# EAGLE design pi_pcb (EAGLE 9.5.1)
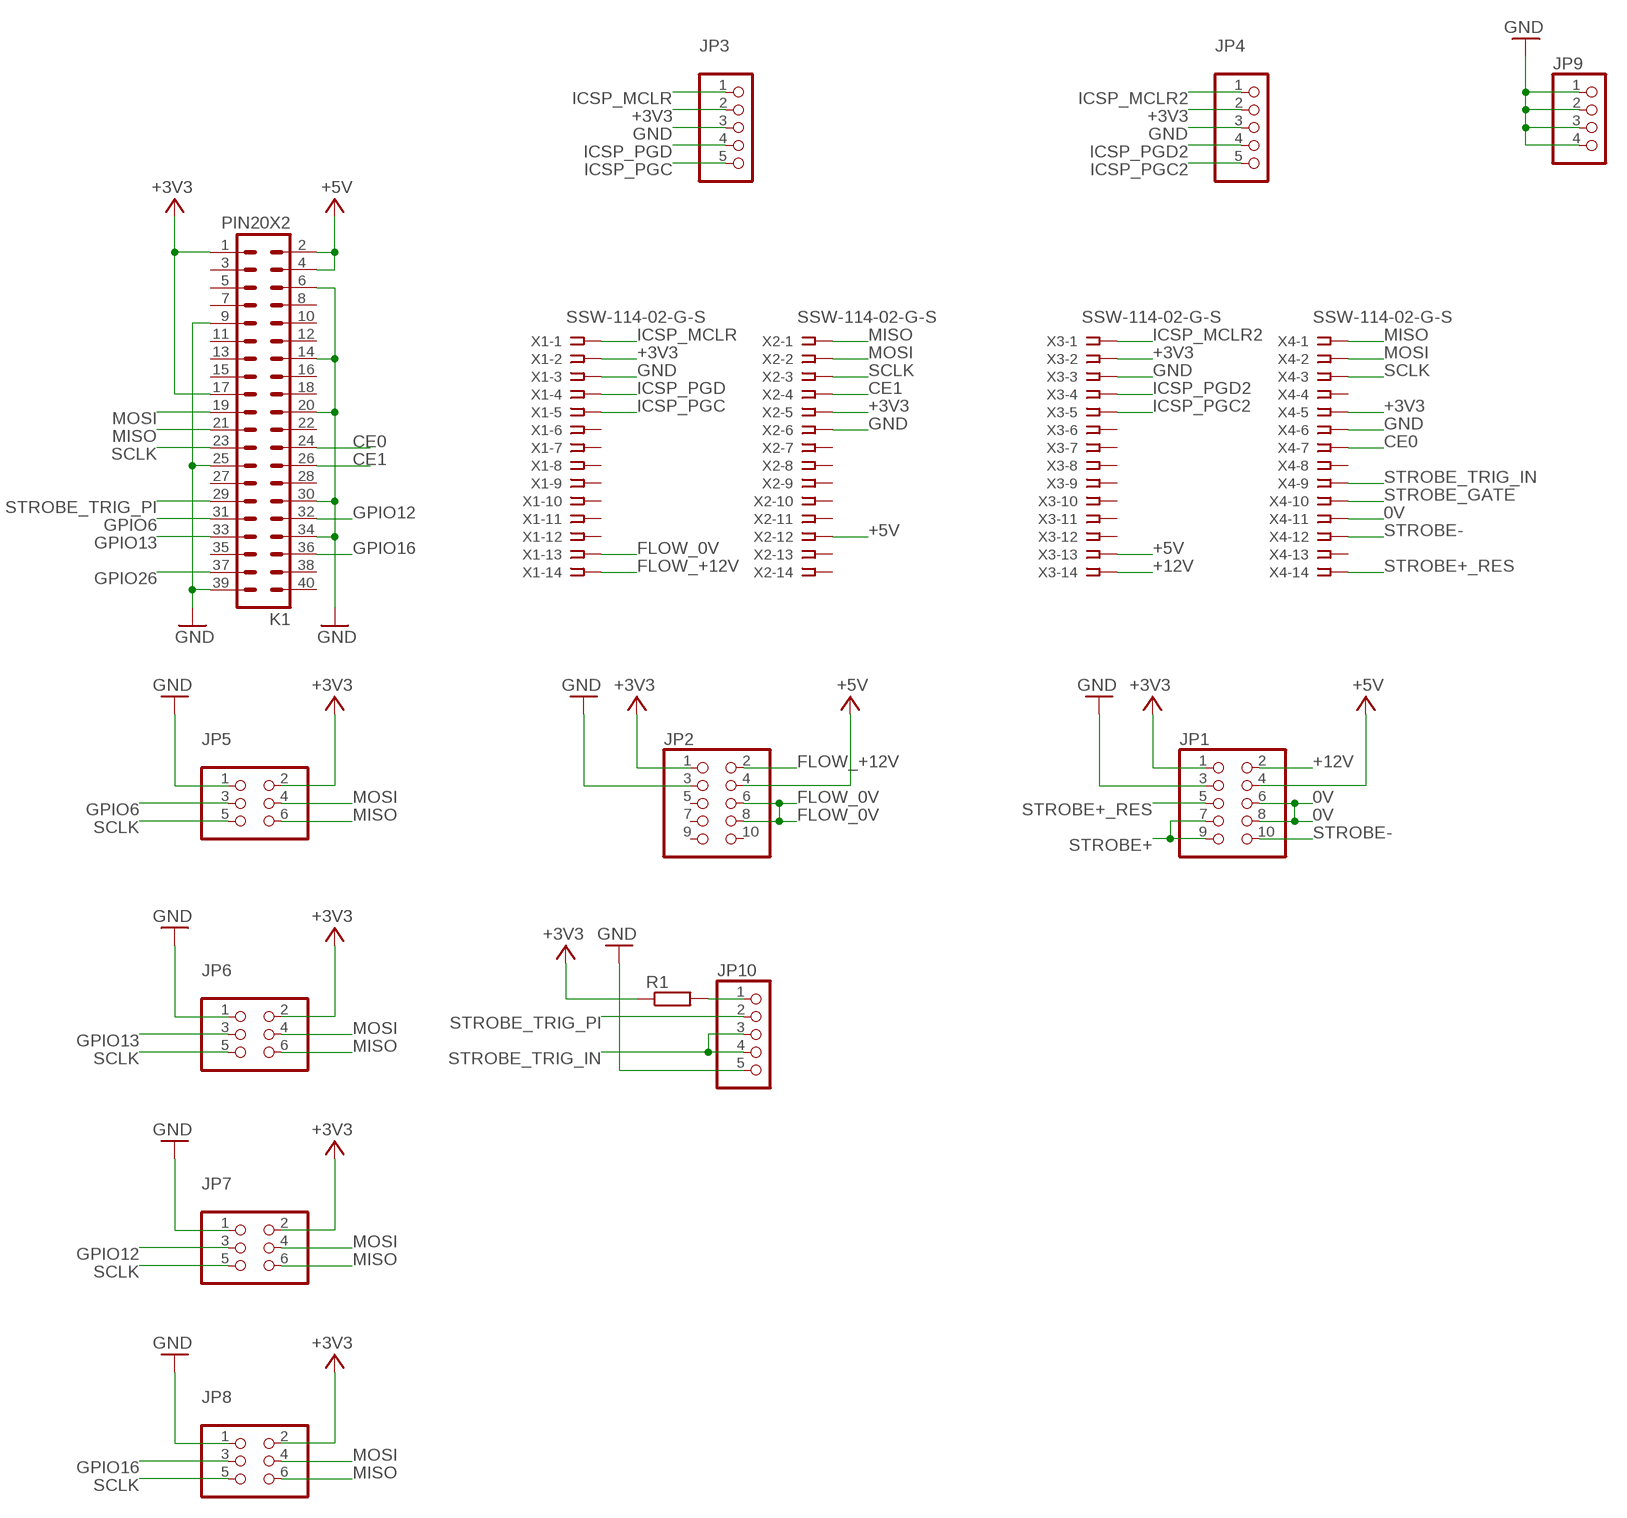
[diagram p0: schematic, sheet 1]

## Parts
JP1  PINHD-2X5  [2X05]
JP2  PINHD-2X5  [2X05]
JP3  PINHD-1X5  [1X05]
JP4  PINHD-1X5  [1X05]
JP5  PINHD-2X3  [2X03]
JP6  PINHD-2X3  [2X03]
JP7  PINHD-2X3  [2X03]
JP8  PINHD-2X3  [2X03]
JP9  PINHD-1X4  [1X04]
JP10  PINHD-1X5  [1X05]
K1  PIN20X2  [PIN_20X2]
R1  R-EU_R1206  [R1206]
X1  SSW-114-02-G-S  [SSW-114-02-G-S]
X2  SSW-114-02-G-S  [SSW-114-02-G-S]
X3  SSW-114-02-G-S  [SSW-114-02-G-S]
X4  SSW-114-02-G-S  [SSW-114-02-G-S]

## Nets
0V: JP1.6 JP1.8 X4.11
+3V3: JP1.1 JP2.1 JP3.2 JP4.2 JP5.2 JP6.2 JP7.2 JP8.2 K1.1 K1.17 R1.1 X1.2 X2.5 X3.2 X4.5
+5V: JP1.4 JP2.4 K1.2 K1.4 X2.12 X3.13
+12V: JP1.2 X3.14
CE0: K1.24 X4.7
CE1: K1.26 X2.4
FLOW_0V: JP2.6 JP2.8 X1.13
FLOW_+12V: JP2.2 X1.14
GND: JP1.3 JP2.3 JP3.3 JP4.3 JP5.1 JP6.1 JP7.1 JP8.1 JP9.1 JP9.2 JP9.3 JP9.4 JP10.5 K1.6 K1.9 K1.14 K1.20 K1.25 K1.30 K1.34 K1.39 X1.3 X2.6 X3.3 X4.6
GPIO6: JP5.3 K1.31
GPIO12: JP7.3 K1.32
GPIO13: JP6.3 K1.33
GPIO16: JP8.3 K1.36
GPIO26: K1.37
ICSP_MCLR: JP3.1 X1.1
ICSP_MCLR2: JP4.1 X3.1
ICSP_PGC: JP3.5 X1.5
ICSP_PGC2: JP4.5 X3.5
ICSP_PGD: JP3.4 X1.4
ICSP_PGD2: JP4.4 X3.4
MISO: JP5.6 JP6.6 JP7.6 JP8.6 K1.21 X2.1 X4.1
MOSI: JP5.4 JP6.4 JP7.4 JP8.4 K1.19 X2.2 X4.2
N$1: JP10.1 R1.2
SCLK: JP5.5 JP6.5 JP7.5 JP8.5 K1.23 X2.3 X4.3
STROBE+: JP1.7 JP1.9
STROBE+_RES: JP1.5 X4.14
STROBE-: JP1.10 X4.12
STROBE_GATE: X4.10
STROBE_TRIG_IN: JP10.3 JP10.4 X4.9
STROBE_TRIG_PI: JP10.2 K1.29
Unconnected: JP2.5 JP2.7 JP2.9 JP2.10 K1.3 K1.5 K1.7 K1.8 K1.10 K1.11 K1.12 K1.13 K1.15 K1.16 K1.18 K1.22 K1.27 K1.28 K1.35 K1.38 K1.40 X1.6 X1.7 X1.8 X1.9 X1.10 X1.11 X1.12 X2.7 X2.8 X2.9 X2.10 X2.11 X2.13 X2.14 X3.6 X3.7 X3.8 X3.9 X3.10 X3.11 X3.12 X4.4 X4.8 X4.13

## Library data of the parts
JP1 JP2 = pinhead:PINHD-2X5: PIN HEADER
JP3 JP4 JP10 = pinhead:PINHD-1X5: PIN HEADER
JP5-JP8 = pinhead:PINHD-2X3: PIN HEADER
JP9 = pinhead:PINHD-1X4: PIN HEADER
K1 = FLYFISH:PIN20X2; OC_FARNELL: unknown
R1 = rcl:R-EU_: RESISTOR, European symbol; SPICEPREFIX: R
X1-X4 = con-samtec:SSW-114-02-G-S: THROUGH-HOLE .025" SQ POST SOCKET Source: Samtec SSW.pdf; MF: Samtec Inc.; MPN: SSW-114-02-G-S; OC_FARNELL: unknown; OC_NEWARK: 11P9549

## Board
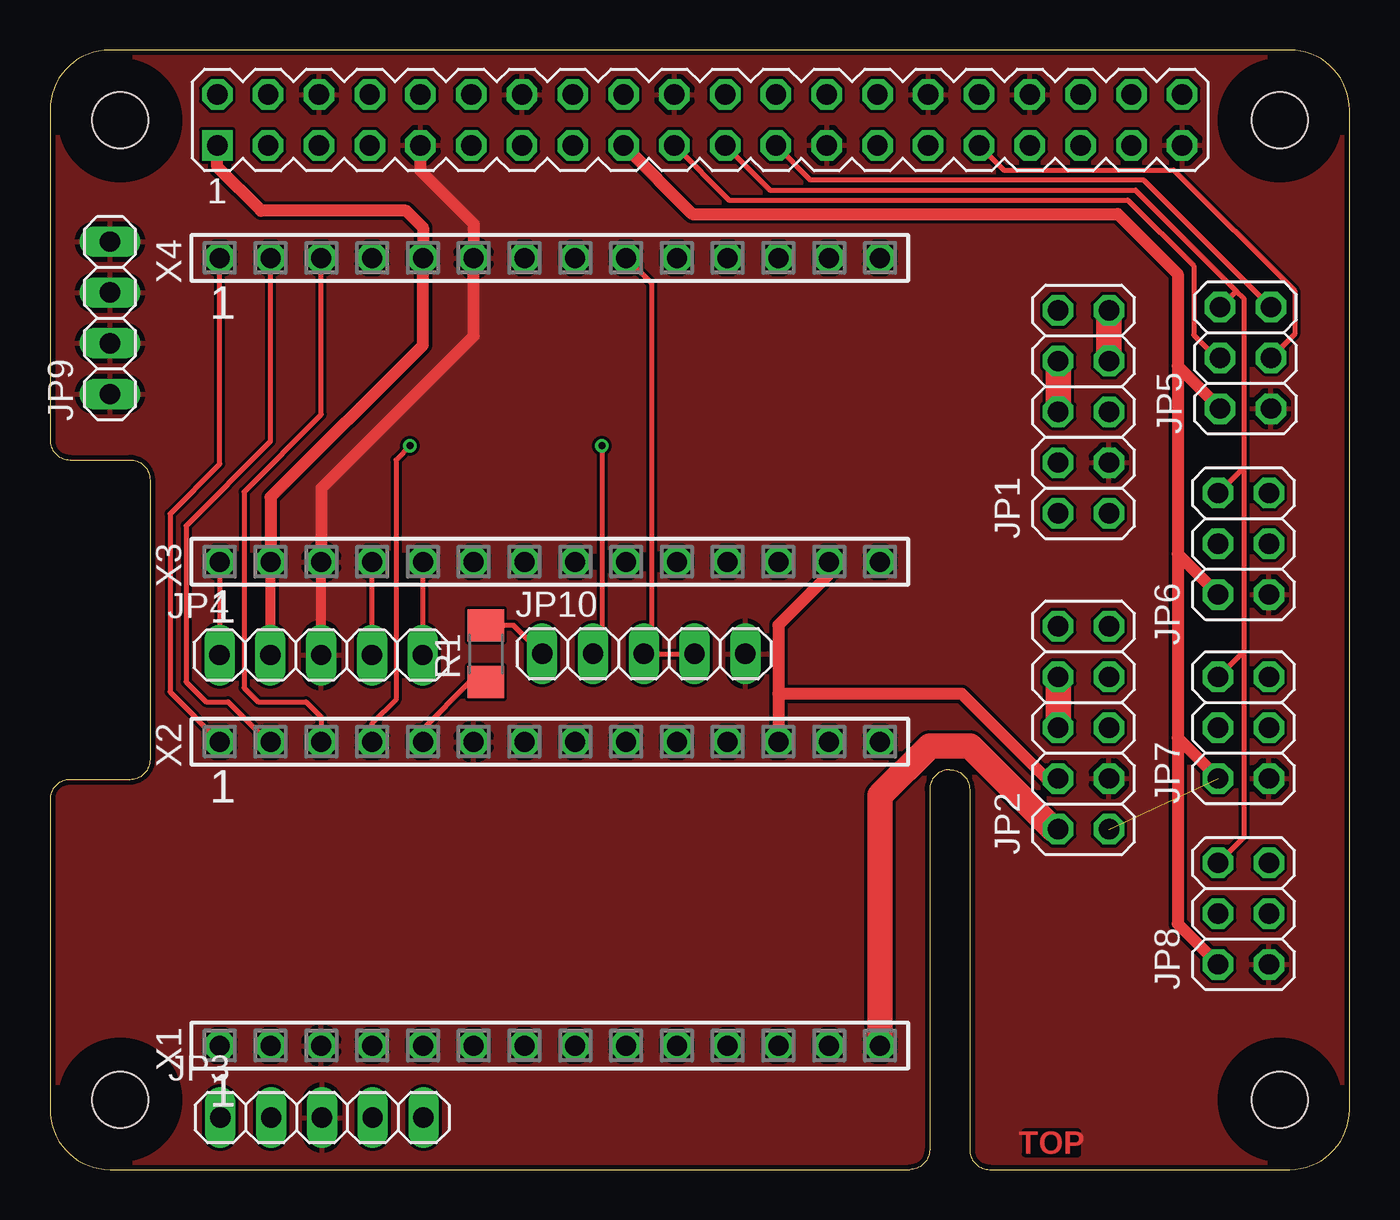
[diagram p1: board, top side]
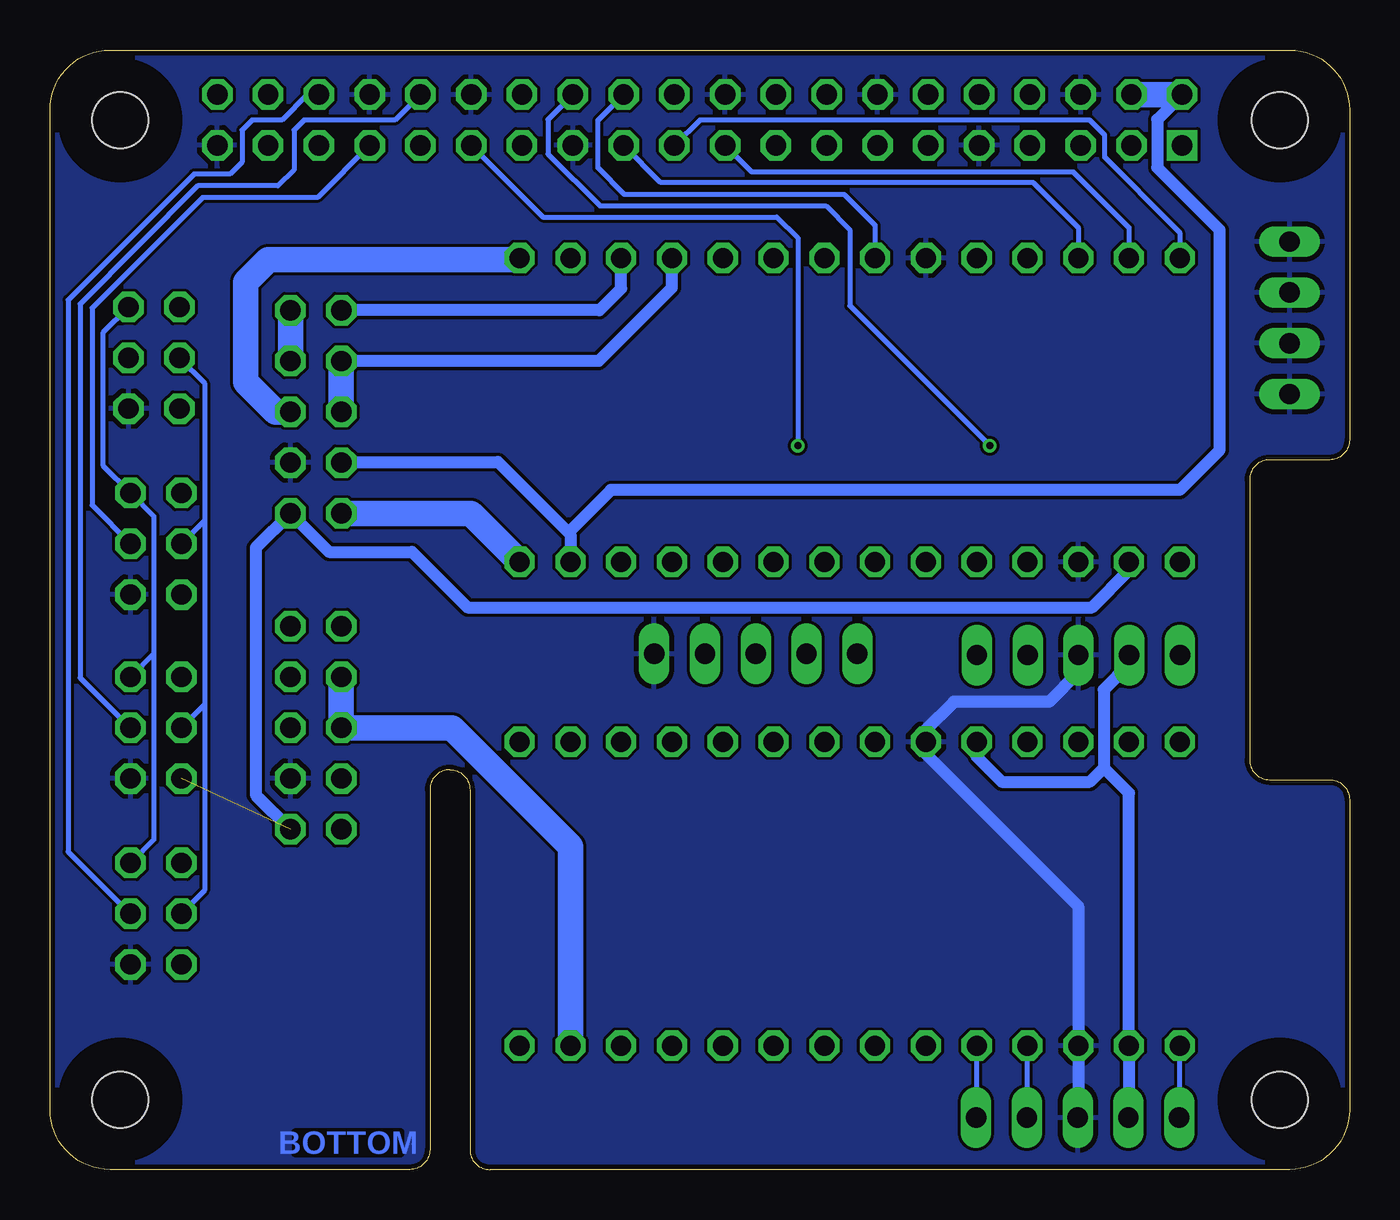
[diagram p2: board, bottom side, seen from below]

Size 65 x 56 mm. Coordinates in mm from the lower left corner, seen from the top.
Outline: 0,3 arc90 3,0 43,0 arc90 44,1 44,19 arc-90 45,20 arc-90 46,19 46,1 arc90 47,0 62,0 arc90 65,3 65,53 arc90 62,56 3,56 arc90 0,53 0,36.5 arc90 1,35.5 4,35.5 arc-90 5,34.5 5,20.5 arc-90 4,19.5 1,19.5 arc90 0,18.5 0,3
Copper layers (1*16): Top 0.035mm / dielectric 1.5mm / Bottom 0.035mm
Design rules "ITEADstudio_DRC": minimum track width 6mil, minimum drill 12mil, track to track 6mil, track to pad 6mil, pad to pad 6mil, via to via 6mil, smd to smd 0mil, copper to edge 10mil, drill to drill 10mil, minimum pad ring 10mil, minimum via ring 6mil, stop-mask expansion 2mil, vias tented up to drill 100mil, thermal gap 10mil
Holes 2.8 mm at 3.5,3.5 3.5,52.5 61.5,52.5 61.5,3.5
tRestrict: area 1.9,51 to 5,54; area 60,51 to 63,54; area 60,1.9 to 63,5; area 1.9,1.9 to 5,5
bRestrict: area 1.9,1.9 to 5,5; area 1.9,51 to 5,54; area 60,1.9 to 63,5; area 60,51 to 63,54

### Footprints (pad centres in the part's own frame; a part is rotated, then mirrored left to right if it is on the bottom)
2X05 = drill 1.016 octagon: 1 -5.08,-1.27; 2 -5.08,1.27; 3 -2.54,-1.27; 4 -2.54,1.27; 5 0,-1.27; 6 0,1.27; 7 2.54,-1.27; 8 2.54,1.27; 9 5.08,-1.27; 10 5.08,1.27
1X05 = drill 1.016 long: 1 -5.08,0; 2 -2.54,0; 3 0,0; 4 2.54,0; 5 5.08,0
2X03 = drill 1.016 octagon: 1 -2.54,-1.27; 2 -2.54,1.27; 3 0,-1.27; 4 0,1.27; 5 2.54,-1.27; 6 2.54,1.27
1X04 = drill 1.016 long: 1 -3.81,0; 2 -1.27,0; 3 1.27,0; 4 3.81,0
PIN_20X2 = drill 1.016 square: 1 -24.13,-1.27 | drill 1.016 octagon: 2 -24.13,1.27; 3 -21.59,-1.27; 4 -21.59,1.27; 5 -19.05,-1.27; 6 -19.05,1.27; 7 -16.51,-1.27; 8 -16.51,1.27; 9 -13.97,-1.27; 10 -13.97,1.27; 11 -11.43,-1.27; 12 -11.43,1.27; 13 -8.89,-1.27; 14 -8.89,1.27; 15 -6.35,-1.27; 16 -6.35,1.27; 17 -3.81,-1.27; 18 -3.81,1.27; 19 -1.27,-1.27; 20 -1.27,1.27; 21 1.27,-1.27; 22 1.27,1.27; 23 3.81,-1.27; 24 3.81,1.27; 25 6.35,-1.27; 26 6.35,1.27; 27 8.89,-1.27; 28 8.89,1.27; 29 11.43,-1.27; 30 11.43,1.27; 31 13.97,-1.27; 32 13.97,1.27; 33 16.51,-1.27; 34 16.51,1.27; 35 19.05,-1.27; 36 19.05,1.27; 37 21.59,-1.27; 38 21.59,1.27; 39 24.13,-1.27; 40 24.13,1.27
R1206 = smd 1.6 x 1.803: 1 -1.422,0; 2 1.422,0
SSW-114-02-G-S = drill 1 pad 1.5 octagon: 1 -16.51,0; 2 -13.97,0; 3 -11.43,0; 4 -8.89,0; 5 -6.35,0; 6 -3.81,0; 7 -1.27,0; 8 1.27,0; 9 3.81,0; 10 6.35,0; 11 8.89,0; 12 11.43,0; 13 13.97,0; 14 16.51,0

### Placement (x,y rotation side)
JP1  51.7,37.9 90 top
JP2  51.7,22.1 90 top
JP3  13.6,2.6 0 top
JP4  13.56,25.73 0 top
JP5  59.8,40.6 90 top
JP6  59.7,31.3 90 top
JP7  59.7,22.1 90 top
JP8  59.7,12.8 90 top
JP9  3,42.6 90 top
JP10  29.7,25.8 0 top
K1  32.5,52.5 0 top
R1  1k  [R1206]  21.8,25.8 90 top
X1  25,6.2 0 top
X2  25,21.4 0 top
X3  25,30.4 0 top
X4  25,45.6 0 top

### Tracks (layer width: path | path; a pad name or v marks a point on that pad's centre or on a via)
0V
  Top 1.27: JP1.6 JP1.8
  Bottom 0.61: JP1.8 37.56,40.44 33.89,44.11 X4.11
  Bottom 1.27: JP1.8 JP1.6
+3V3  (1 unrouted)
  Top 0.254: X2.5 18.65,22.05 20.98,24.38 R1.1
  Top 0.508: JP4.2 X3.2
  Top 0.61: K1.1 8.37,50.13 10.55,47.95 17.82,47.95 18.65,47.12 X4.5 18.65,41.25 11.03,33.63 X3.2 | K1.17 32.12,47.8 53.4,47.8 56.4,44.8 56.4,40.19 | 56.4,40.19 56.4,30.79 | 56.4,30.79 JP6.2 | JP5.2 56.4,40.19 | 56.4,30.79 56.4,21.59 | 56.4,21.59 JP7.2 | 56.4,21.59 56.4,12.29 JP8.2
  Bottom 0.61: 12.3,20.1 12.3,24 11.02,25.28 JP4.2 | 12.3,20.1 13,19.4 17.4,19.4 18.65,20.65 X2.5 | 12.3,20.1 11.03,18.83 X1.2 11.03,2.6 JP3.2 | JP2.1 54.7,18.75 54.7,31.09 JP1.1 51.05,30.9 46.9,30.9 44.12,28.12 12.88,28.12 11.03,29.97 X3.2
+5V
  Top 0.61: 36.43,23.8 36.43,27.23 38.97,29.77 X3.13 | JP2.4 49.84,19.56 45.6,23.8 36.43,23.8 | 36.43,23.8 X2.12
  Bottom 0.61: K1.2 9.62,52.52 9.62,50.12 6.5,47 6.5,36 8.5,34 36.94,34 38.97,31.97 38.97,31.77 | 38.97,31.77 42.6,35.4 50.39,35.4 JP1.4 | 38.97,31.77 X3.13
  Bottom 1.27: K1.2 K1.4
+12V
  Bottom 1.27: X3.14 43.93,32.82 JP1.2
CE0
  Bottom 0.254: K1.24 37.6,52.48 37.6,50.1 36.27,48.77 25.27,48.77 23.73,47.23 X4.7
CE1  (via drill 0.35)
  Top 0.254: v18,36.2 17.3,35.5 17.3,23.5 16.11,22.31 X2.4
  Bottom 0.254: K1.26 40.1,52.52 40.1,50.8 37.5,48.2 26.2,48.2 25,47 25,43.2 v18,36.2
FLOW_0V
  Top 1.27: JP2.6 JP2.8
  Bottom 1.27: X1.13 38.97,16.17 44.9,22.1 JP2.6 JP2.8
FLOW_+12V
  Top 1.27: X1.14 41.51,18.71 44,21.2 46,21.2 48.5,18.7 49,18.2 50.18,17.02 JP2.2
GND
  Top 0.508: JP4.3 X3.3
  Top 0.61: K1.9 18.53,49.97 21.19,47.31 X4.6 21.19,41.69 13.57,34.07 X3.3
  Bottom 0.61: JP3.3 13.57,2.6 X1.3 13.57,13.17 21.19,20.79 X2.6 21.19,22.01 19.8,23.4 15.03,23.4 13.56,24.86 JP4.3
  pour Bottom: 0,3 arc90 3,0 43,0 arc90 44,1 44,19 arc-90 45,20 arc-90 46,19 46,1 arc90 47,0 62,0 arc90 65,3 65,53 arc90 62,56 3,56 arc90 0,53 0,36.5 arc90 1,35.5 4,35.5 arc-90 5,34.5 5,20.5 arc-90 4,19.5 1,19.5 arc90 0,18.5
  pour Top: 0,3 arc90 3,0 43,0 arc90 44,1 44,19 arc-90 45,20 arc-90 46,19 46,1 arc90 47,0 62,0 arc90 65,3 65,53 arc90 62,56 3,56 arc90 0,53 0,36.5 arc90 1,35.5 4,35.5 arc-90 5,34.5 5,20.5 arc-90 4,19.5 1,19.5 arc90 0,18.5
GPIO6
  Top 0.254: K1.31 47.7,50 56.2,50 62.25,43.95 62.25,41.78 JP5.3
GPIO12
  Bottom 0.254: K1.32 47.74,52.5 52.3,52.5 52.8,52 52.8,50 53.6,49.2 57.6,49.2 63.5,43.3 63.5,24.6 61,22.1 JP7.3
GPIO13
  Bottom 0.254: K1.33 51.62,48.62 57.38,48.62 62.9,43.1 62.9,33.23 JP6.3
GPIO16
  Bottom 0.254: K1.36 52.13,53.77 53.4,52.5 54.9,52.5 55.4,52 55.4,50.4 56,49.8 57.8,49.8 64.1,43.5 64.1,15.9 61,12.8 JP8.3
ICSP_MCLR
  Bottom 0.254: X1.1 8.52,6.17 JP3.1
ICSP_MCLR2
  Top 0.254: X3.1 JP4.1
ICSP_PGC
  Bottom 0.254: JP3.5 18.65,2.6 X1.5
ICSP_PGC2
  Top 0.254: JP4.5 X3.5
ICSP_PGD
  Bottom 0.254: JP3.4 16.11,2.6 X1.4
ICSP_PGD2
  Top 0.254: JP4.4 X3.4
MISO
  Top 0.254: K1.21 36,49 54.29,49 59.34,43.95 | 59.7,35.11 JP6.6 | 59.7,35.11 59.7,43.59 59.34,43.95 | JP5.6 59.34,43.95 | 59.7,35.11 59.7,25.91 | 59.7,25.91 JP7.6 | 59.7,25.91 59.7,16.61 JP8.6 | X4.1 8.49,35.29 6,32.8 6,23.89 X2.1
  Bottom 0.254: K1.21 32.5,52.5 13,52.5 12.25,51.75 12.25,50.63 8.81,47.19 8.49,46.87 X4.1
MOSI
  Top 0.254: K1.19 33.96,48.5 53.9,48.5 57.2,45.2 57.2,41.75 58.35,40.6 JP5.4 | X2.2 10.9,21.4 8.9,23.4 7.8,23.4 6.8,24.4 6.8,32.2 11.03,36.43 X4.2
  Bottom 0.254: K1.19 29.9,49.9 13.81,49.9 11.03,47.12 X4.2 | 57.27,32.47 JP6.4 | 57.27,23.27 JP7.4 | 57.27,32.47 57.27,23.27 | 57.27,23.27 57.27,13.96 JP8.4 | JP5.4 57.27,39.34 57.27,32.47
N$1
  Top 0.254: JP10.1 23.2,27.22 R1.2
SCLK
  Top 0.254: K1.23 38.04,49.5 54.7,49.5 JP5.5 | X2.3 13.57,22.63 12.8,23.4 10.4,23.4 9.7,24.1 9.7,33.9 13.57,37.77 X4.3
  Bottom 0.254: K1.23 34.45,49.37 15.82,49.37 13.57,47.12 X4.3 | JP5.5 62.33,41.88 62.33,35.2 JP6.5 59.8,32.67 59.8,25.8 | 59.8,25.8 JP7.5 | 59.8,25.8 59.8,16.5 JP8.5
STROBE+
  Top 1.27: JP1.7 JP1.9
  Bottom 1.27: JP1.9 JP1.7
STROBE+_RES
  Bottom 1.27: JP1.5 53.7,37.9 55.2,39.4 55.2,44.4 54.08,45.52 43,45.52 41.61,45.52 41.59,45.52 X4.14
STROBE-
  Bottom 0.61: JP1.10 37.52,42.98 36.43,44.07 X4.12
STROBE_TRIG_IN
  Top 0.254: X4.9 30.1,44.31 30.1,26.2 JP10.3 JP10.4
STROBE_TRIG_PI  (via drill 0.35)
  Top 0.254: v27.6,36.2 27.6,26.24 JP10.2
  Bottom 0.254: K1.29 40.35,47.65 28.65,47.65 27.6,46.6 v27.6,36.2

### Text on the board
Top: TOP
Bottom: BOTTOM
tText: Strobe | Heaters | Strobe | Flow | Pressure/Flow